# Altium schematic sheet Multi-channel_diff-pairs.SchDoc: Pin Swapping
size 431 x 279 mm
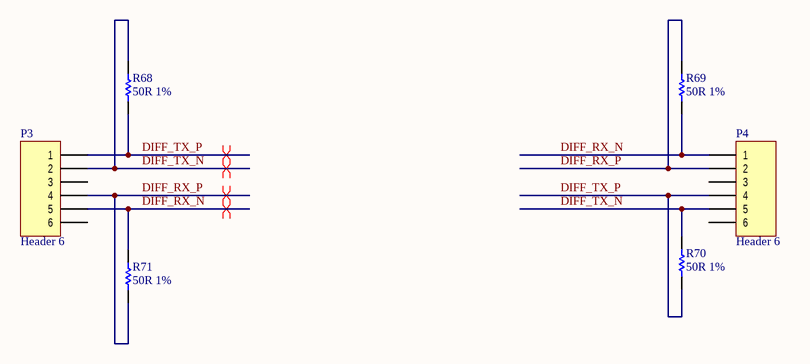
[diagram p0: Multi-channel_diff-pairs.SchDoc]

## Parts
P3  Header 6  [HDR1X6]
P4  Header 6  [HDR1X6]
R68  50R 1%  [RESC2012]
R69  50R 1%  [RESC2012]
R70  50R 1%  [RESC2012]
R71  50R 1%  [RESC2012]

## Nets
DIFF_RX_N: P3.5 P4.1 R69.2 R71.1
DIFF_RX_P: P3.4 P4.2 R69.1 R71.2
DIFF_TX_N: P3.2 P4.5 R68.1 R70.1
DIFF_TX_P: P3.1 P4.4 R68.2 R70.2

Not connected (* = marked no-connect by the designer): P3 3 6; P4 3 6

## Layout directives
differential pair: DIFF_RX_N, DIFF_RX_P, DIFF_TX_N, DIFF_TX_P

## Notes on the sheet
- 8
- 7
- 6
- 5
- 4
- 3
- DWG. NO.
- REV.
- SHT.
- 2
- 1
- THIS DOCUMENT AND THE DATA DISCLOSED HEREIN OR HEREWITH IS THE PROPERTY OF ALTIUM LIMITED AND MAY BE FREELY DISTRIBUTED IN WHOLE. NO RIGHTS ARE RESERVED OR EXPRESS OR IMPLIED WARANTEE GIVEN.
- REVISION
- DESCRIPTION
- DATE
- APPROVED
- F
- E
- D
- C
- B
- A
- TITLE
- SCALE:
- SIZE
- CAGE CODE
- FILE NAME
- DWG NO.
- SHEET
- OF
- REV

## Library data of the parts
P3 P4 = Header 6: Header, 6-Pin; LatestRevisionDate: 17-Jul-2002; LatestRevisionNote: Re-released for DXP Platform.; Publisher: Altium Limited
R68-R71 = RES: Resistor; Design Item Id: RES-270R-1%-0805